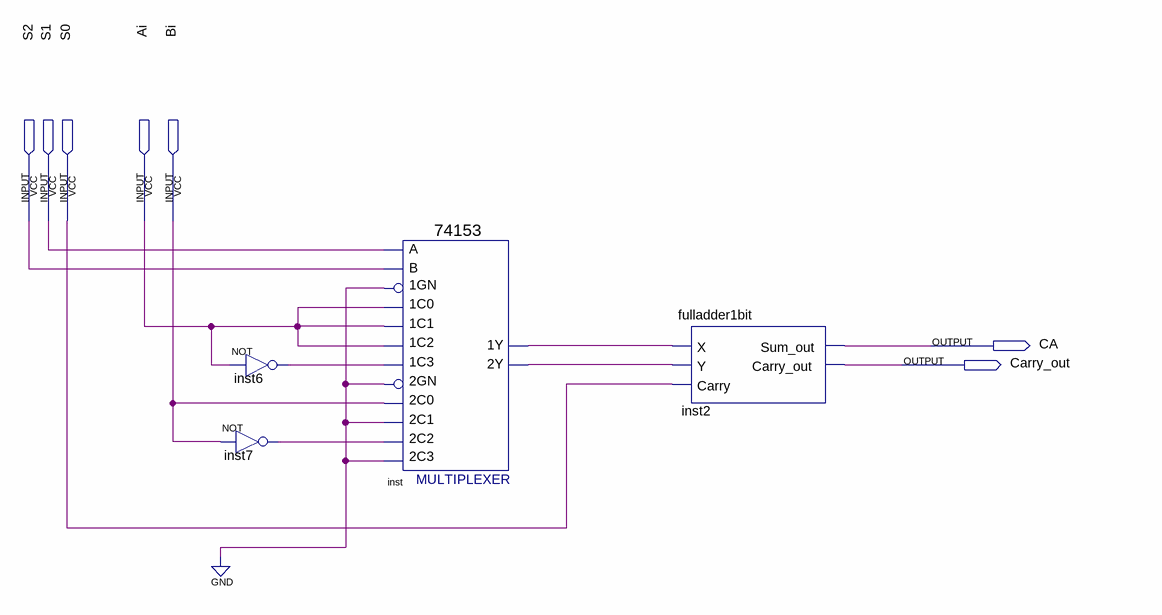
[diagram p0: schematic sheet]
// Quartus schematic arithcircuit4bits.bdf as structural Verilog: 4 symbols, 7 pins
module arithcircuit4bits (
  input  S2,
  input  S1,
  input  S0,
  input  Ai,
  input  Bi,
  output CA,
  output Carry_out
);

  wire inst6_out, inst7_out, inst_1y, inst_2y;

  not inst6 (inst6_out, Ai);
  not inst7 (inst7_out, Bi);
  \74153  inst (
    .\1C1 (Ai), .\1GN (1'b0), .\1C0 (Ai), .\2C0 (Bi), .\2GN (1'b0), .\2C2 (inst7_out), .\1C2 (Ai),
    .\1C3 (inst6_out), .B(S2), .A(S1), .\2C1 (1'b0), .\2C3 (1'b0), .\1Y (inst_1y), .\2Y (inst_2y));
  fulladder1bit inst2 (.X(inst_1y), .Y(inst_2y), .Carry(S0), .Sum_out(CA), .Carry_out(Carry_out));
endmodule
